# Altium schematic sheet P02 Block Diagram.SchDoc
size 420 x 297 mm
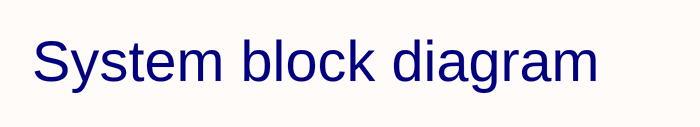
[diagram p0: P02 Block Diagram.SchDoc]

## Notes on the sheet
- System block diagram